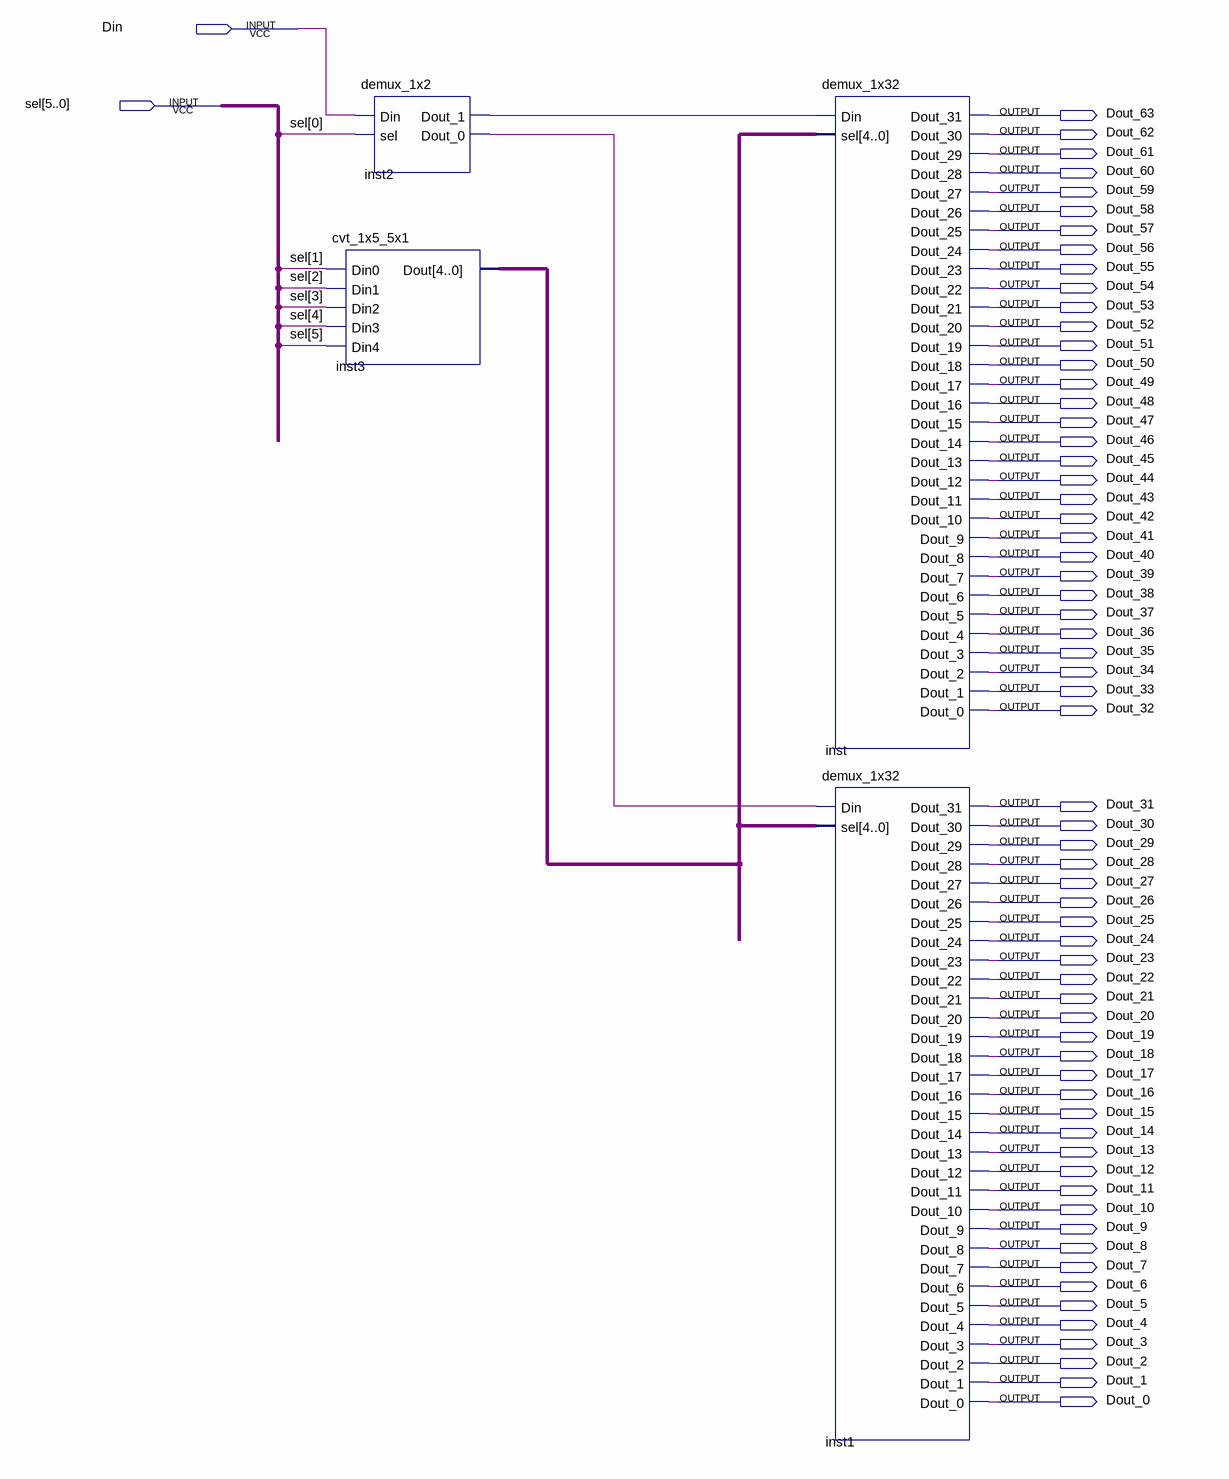
[diagram p0: schematic sheet]
// Quartus schematic demux_1x64.bdf as structural Verilog: 4 symbols, 66 pins
module demux_1x64 (
  input  Din,
  input  [5:0] sel,
  output Dout_63,
  output Dout_62,
  output Dout_61,
  output Dout_60,
  output Dout_59,
  output Dout_58,
  output Dout_57,
  output Dout_56,
  output Dout_55,
  output Dout_54,
  output Dout_53,
  output Dout_52,
  output Dout_51,
  output Dout_50,
  output Dout_49,
  output Dout_48,
  output Dout_47,
  output Dout_46,
  output Dout_45,
  output Dout_44,
  output Dout_43,
  output Dout_42,
  output Dout_41,
  output Dout_40,
  output Dout_39,
  output Dout_38,
  output Dout_37,
  output Dout_36,
  output Dout_35,
  output Dout_34,
  output Dout_33,
  output Dout_32,
  output Dout_31,
  output Dout_30,
  output Dout_29,
  output Dout_28,
  output Dout_27,
  output Dout_26,
  output Dout_25,
  output Dout_24,
  output Dout_23,
  output Dout_22,
  output Dout_21,
  output Dout_20,
  output Dout_19,
  output Dout_18,
  output Dout_17,
  output Dout_16,
  output Dout_15,
  output Dout_14,
  output Dout_13,
  output Dout_12,
  output Dout_11,
  output Dout_10,
  output Dout_9,
  output Dout_8,
  output Dout_7,
  output Dout_6,
  output Dout_5,
  output Dout_4,
  output Dout_3,
  output Dout_2,
  output Dout_1,
  output Dout_0
);

  wire inst2_dout_0, inst2_dout_1;
  wire [4:0] inst3_dout;

  cvt_1x5_5x1 inst3 (.Din0(sel[1]), .Din1(sel[2]), .Din2(sel[3]), .Din3(sel[4]), .Din4(sel[5]), .Dout(inst3_dout));
  demux_1x2 inst2 (.Din(Din), .sel(sel[0]), .Dout_1(inst2_dout_1), .Dout_0(inst2_dout_0));
  demux_1x32 inst (
    .Din(inst2_dout_1), .sel(inst3_dout), .Dout_31(Dout_63), .Dout_30(Dout_62), .Dout_29(Dout_61),
    .Dout_28(Dout_60), .Dout_27(Dout_59), .Dout_26(Dout_58), .Dout_25(Dout_57), .Dout_24(Dout_56),
    .Dout_23(Dout_55), .Dout_22(Dout_54), .Dout_21(Dout_53), .Dout_20(Dout_52), .Dout_19(Dout_51),
    .Dout_18(Dout_50), .Dout_17(Dout_49), .Dout_16(Dout_48), .Dout_15(Dout_47), .Dout_14(Dout_46),
    .Dout_13(Dout_45), .Dout_12(Dout_44), .Dout_11(Dout_43), .Dout_10(Dout_42), .Dout_9(Dout_41),
    .Dout_8(Dout_40), .Dout_7(Dout_39), .Dout_6(Dout_38), .Dout_5(Dout_37), .Dout_4(Dout_36),
    .Dout_3(Dout_35), .Dout_2(Dout_34), .Dout_1(Dout_33), .Dout_0(Dout_32));
  demux_1x32 inst1 (
    .Din(inst2_dout_0), .sel(inst3_dout), .Dout_31(Dout_31), .Dout_30(Dout_30), .Dout_29(Dout_29),
    .Dout_28(Dout_28), .Dout_27(Dout_27), .Dout_26(Dout_26), .Dout_25(Dout_25), .Dout_24(Dout_24),
    .Dout_23(Dout_23), .Dout_22(Dout_22), .Dout_21(Dout_21), .Dout_20(Dout_20), .Dout_19(Dout_19),
    .Dout_18(Dout_18), .Dout_17(Dout_17), .Dout_16(Dout_16), .Dout_15(Dout_15), .Dout_14(Dout_14),
    .Dout_13(Dout_13), .Dout_12(Dout_12), .Dout_11(Dout_11), .Dout_10(Dout_10), .Dout_9(Dout_9),
    .Dout_8(Dout_8), .Dout_7(Dout_7), .Dout_6(Dout_6), .Dout_5(Dout_5), .Dout_4(Dout_4), .Dout_3(Dout_3),
    .Dout_2(Dout_2), .Dout_1(Dout_1), .Dout_0(Dout_0));
endmodule
